# Altium schematic sheet LCD_PWR.SchDoc
size A4; SheetNumber: 5; SheetTotal: 9
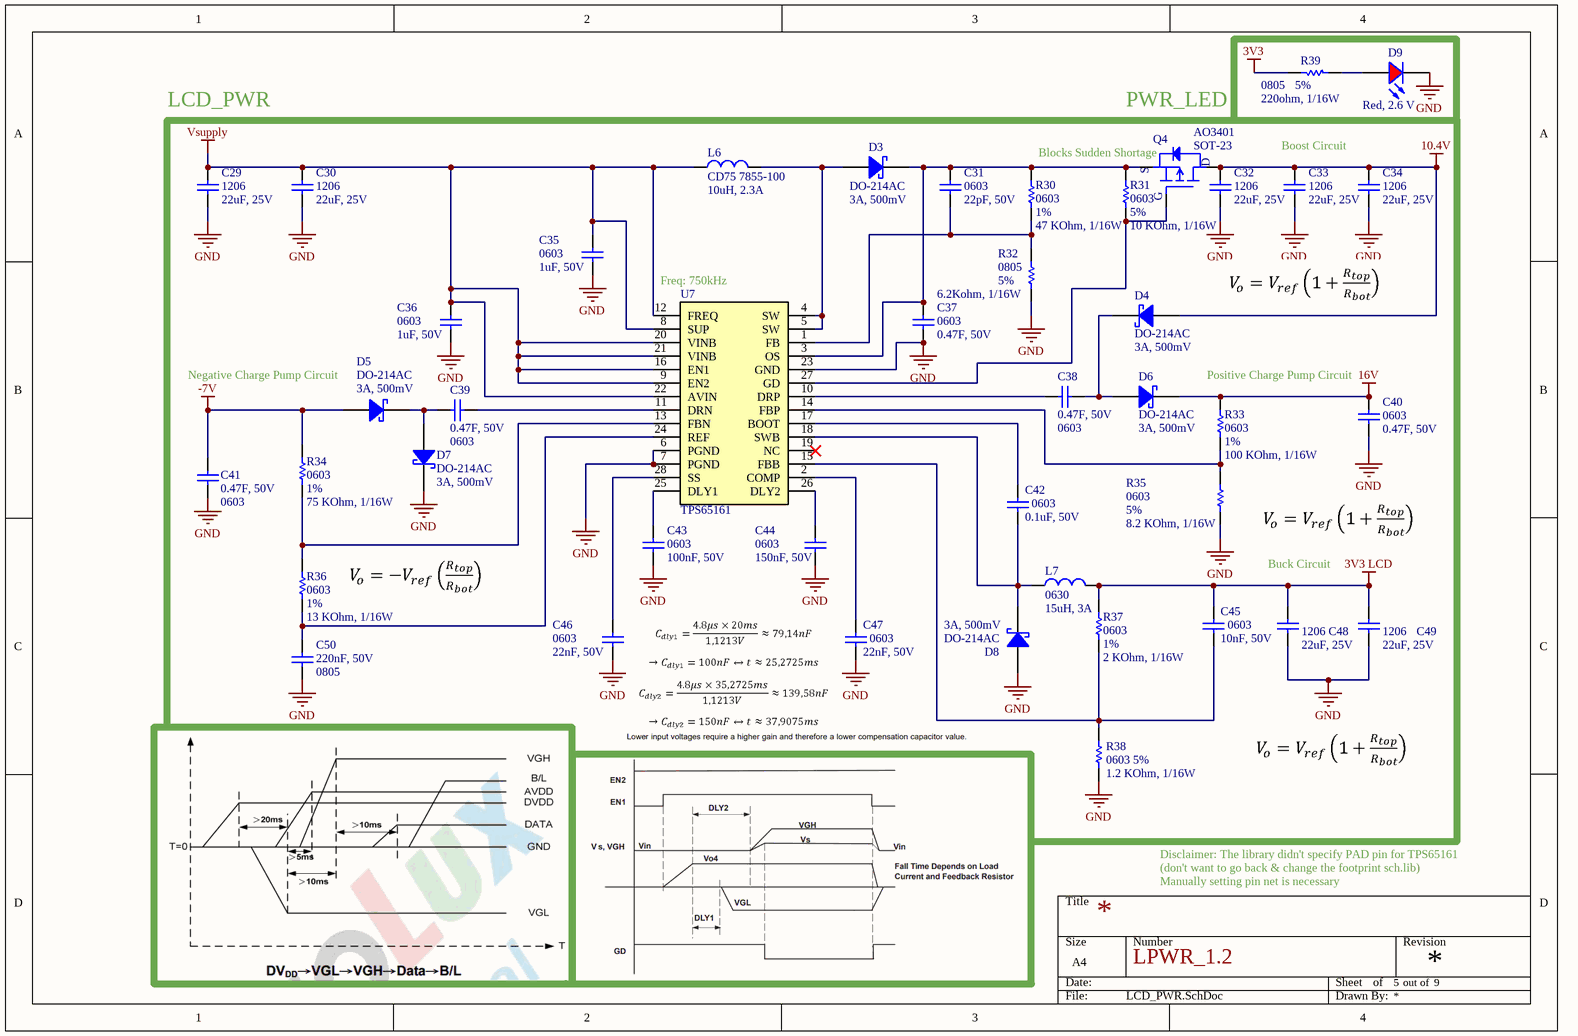
[diagram p0: LCD_PWR.SchDoc]

## Parts
C29  Package: 1206  [C_1206]  (hidden comment: 22uF, 25V)
C30  Package: 1206  [C_1206]  (hidden comment: 22uF, 25V)
C31  Package: 0603  [C_0603]  (hidden comment: 22pF, 50V)
C32  Package: 1206  [C_1206]  (hidden comment: 22uF, 25V)
C33  Package: 1206  [C_1206]  (hidden comment: 22uF, 25V)
C34  Package: 1206  [C_1206]  (hidden comment: 22uF, 25V)
C35  Package: 0603  [C_0603]  (hidden comment: 1uF, 50V)
C36  Package: 0603  [C_0603]  (hidden comment: 1uF, 50V)
C37  Package: 0603  [C_0603]  (hidden comment: 0.47F, 50V)
C38  Package: 0603  [C_0603]  (hidden comment: 0.47F, 50V)
C39  Package: 0603  [C_0603]  (hidden comment: 0.47F, 50V)
C40  Package: 0603  [C_0603]  (hidden comment: 0.47F, 50V)
C41  Package: 0603  [C_0603]  (hidden comment: 0.47F, 50V)
C42  Package: 0603  [C_0603]  (hidden comment: 0.1uF, 50V)
C43  Package: 0603  [C_0603]  (hidden comment: 100nF, 50V)
C44  Package: 0603  [C_0603]  (hidden comment: 150nF, 50V)
C45  Package: 0603  [C_0603]  (hidden comment: 10nF, 50V)
C46  Package: 0603  [C_0603]  (hidden comment: 22nF, 50V)
C47  Package: 0603  [C_0603]  (hidden comment: 22nF, 50V)
C48  Package: 1206  [C_1206]  (hidden comment: 22uF, 25V)
C49  Package: 1206  [C_1206]  (hidden comment: 22uF, 25V)
C50  Package: 0805  [C_0805]  (hidden comment: 220nF, 50V)
D3  Package: DO-214AC  [PKG_SMA (DO-214AC)]  (hidden comment: 3A, 500mV)
D4  Package: DO-214AC  [PKG_SMA (DO-214AC)]  (hidden comment: 3A, 500mV)
D5  Package: DO-214AC  [PKG_SMA (DO-214AC)]  (hidden comment: 3A, 500mV)
D6  Package: DO-214AC  [PKG_SMA (DO-214AC)]  (hidden comment: 3A, 500mV)
D7  Package: DO-214AC  [PKG_SMA (DO-214AC)]  (hidden comment: 3A, 500mV)
D8  Package: DO-214AC  [PKG_SMA (DO-214AC)]  (hidden comment: 3A, 500mV)
D9  Red, 2.6 V  [LED_1206]
L6  Package: CD75 7855-100  [COIL_CDRH]  (hidden comment: 10uH, 2.3A)
L7  Package: 0630  [COIL_74]  (hidden comment: 15uH, 3A)
Q4  AO3401  Package: SOT-23  [PKG_SOT-23]
R30  Package: 0603  Acc: 1%  [R_0603]  (hidden comment: 47 KOhm, 1/16W)
R31  Package: 0603  Acc: 5%  [R_0603]  (hidden comment: 10 KOhm, 1/16W)
R32  Package: 0805  Acc: 5%  [R_0805]  (hidden comment: 6.2Kohm, 1/16W)
R33  Package: 0603  Acc: 1%  [R_0603]  (hidden comment: 100 KOhm, 1/16W)
R34  Package: 0603  Acc: 1%  [R_0603]  (hidden comment: 75 KOhm, 1/16W)
R35  Package: 0603  Acc: 5%  [R_0603]  (hidden comment: 8.2 KOhm, 1/16W)
R36  Package: 0603  Acc: 1%  [R_0603]  (hidden comment: 13 KOhm, 1/16W)
R37  Package: 0603  Acc: 1%  [R_0603]  (hidden comment: 2 KOhm, 1/16W)
R38  Package: 0603  Acc: 5%  [R_0603]  (hidden comment: 1.2 KOhm, 1/16W)
R39  Package: 0805  Acc: 5%  [R_0805]  (hidden comment: 220ohm, 1/16W)
U7  TPS65161  [PKG_HTSSOP-28]

## Nets
3V3: R39.2
3V3 LCD: C45.2 C48.2 C49.2 L7.2 R37.2
10.4V: C32.2 C33.2 C34.2 D4.2(A) Q4.3(D)
16V: C40.2 D6.1(K) R33.2
-7V: C41.1 D5.2(A) R34.2
GND: C29.1 C30.1 C32.1 C33.1 C34.1 C35.1 C36.1 C37.1 C40.1 C41.2 C43.1 C44.1 C46.1 C47.1 C48.1 C49.1 C50.2 D7.1(K) D8.2(A) D9.1(K) R32.1 R35.1 R38.1 U7.6(PGND) U7.7(PGND) U7.23(GND)
Vsupply: C29.2 C30.2 C35.2 C36.2 L6.1 U7.8(SUP) U7.9(EN2) U7.12(FREQ) U7.16(EN1) U7.20(VINB) U7.21(VINB) U7.22(AVIN)
NetC31_1: C31.1 R30.1 R32.2 U7.1(FB)
NetC31_2: C31.2 C37.2 D3.1(K) Q4.2(S) R30.2 R31.2 U7.3(OS)
NetC38_1: C38.1 D4.1(K) D6.2(A)
NetC38_2: C38.2 U7.10(DRP)
NetC39_1: C39.1 U7.11(DRN)
NetC39_2: C39.2 D5.1(K) D7.2(A)
NetC42_1: C42.1 D8.1(K) L7.1 U7.18(SWB)
NetC42_2: C42.2 U7.17(BOOT)
NetC43_2: C43.2 U7.25(DLY1)
NetC44_2: C44.2 U7.26(DLY2)
NetC45_1: C45.1 R37.1 R38.2 U7.15(FBB)
NetC46_2: C46.2 U7.28(SS)
NetC47_2: C47.2 U7.2(COMP)
NetC50_1: C50.1 R36.1 U7.24(REF)
NetD3_2: D3.2(A) L6.2 U7.4(SW) U7.5(SW)
NetD9_2: D9.2(A) R39.1
NetQ4_1: Q4.1(G) R31.1 U7.27(GD)
NetR33_1: R33.1 R35.2 U7.14(FBP)
NetR34_1: R34.1 R36.2 U7.13(FBN)

Not connected (* = marked no-connect by the designer): U7 19(NC)*

## Notes on the sheet
- LCD_PWR
- PWR_LED
- (near Q4) Blocks Sudden Shortage
- Boost Circuit
- (near U7) Freq: 750kHz
- (near D5) Negative Charge Pump Circuit
- Positive Charge Pump Circuit
- Buck Circuit
- Disclaimer: The library didn't specify PAD pin for TPS65161
- (don't want to go back & change the footprint sch.lib)
- Manually setting pin net is necessary
- LPWR_1.2
- out of

## Library data of the parts
C29 C30 C32-C34 C48 C49 = CAP_1206: Manufacturer 1: Vishay; Manufacturer Part Number 1: CAP0805; Supplier 1: Thegioiic; Datasheet: https://www.mouser.de/datasheet/2/447/PYu_RC_Group_51_RoHS_L_11-1984063.pdf; Supplier Link: N/a; Value: 22uF, 25V
C31 C35-C47 = CAP_0603: Manufacturer 1: Vishay; Manufacturer Part Number 1: CAP0603; Supplier 1: Thegioiic; Datasheet: https://www.mouser.de/datasheet/2/447/PYu_RC_Group_51_RoHS_L_11-1984063.pdf; Supplier Link: N/a
  C31: Value: 22pF, 50V
  C35 C36: Value: 1uF, 50V
  C37-C41: Value: 0.47F, 50V
  C42: Value: 0.1uF, 50V
  C43: Value: 100nF, 50V
  C44: Value: 150nF, 50V
  C45: Value: 10nF, 50V
  C46 C47: Value: 22nF, 50V
C50 = CAP_0805: Manufacturer 1: Vishay; Manufacturer Part Number 1: CAP0805; Supplier 1: Thegioiic; Datasheet: https://www.mouser.de/datasheet/2/447/PYu_RC_Group_51_RoHS_L_11-1984063.pdf; Supplier Link: N/a; Value: 220nF, 50V
D3-D8 = SCHOTTKY: SS34; Manufacturer 1: OEM; Manufacturer Part Number 1: N/a; ComponentLink1Description: Datasheet; ComponentLink1URL: https://www.vishay.com/doc?89055; Supplier 1: Thegioiic; Datasheet: N/a; Supplier Link: N/a; Value: 3A, 500mV
D9 = RED: Red LED; Manufacturer 1: LITE-ON; Manufacturer Part Number 1: LEDR; ComponentLink1Description: Datasheet link; ComponentLink1URL: N/A; ComponentLink2Description: Supplier 1 URL; ComponentLink2URL: https://www.mouser.vn/ProductDetail/ROHM-Semiconductor/SML-H12U8TT86C?qs=HXFqYaX1Q2xs%2F%252BL6XLQEvw%3D%3D; ComponentLink3Description: Supplier 2 URL; ComponentLink3URL: https://www.digikey.com/en/products/detail/liteon/LTST-C171KRKT/386801; ComponentLink4Description: Supplier 3 URL; ComponentLink4URL: https://www.thegioiic.com/led-do-0805-dan-smd-trong-suot-harvatek; Supplier 1: ICDAYROI; Datasheet: https://www.mouser.com/datasheet/2/239/LTST-S326KGKFKT-1143909.pdf?srsltid=AfmBOorgg6Gh4PD3T9FRO6Da906Aqdqx3RSjbUQRSIXh-3hATfgAoF8Q; Supplier Link: https://icdayroi.com/led-smd-0805; Package: 1206; Value: Red, 2.6 V
L6 = IN_CD104_100: Manufacturer 1: OEM; Manufacturer Part Number 1: N/a; ComponentLink2Description: Supplier 1 URL; ComponentLink2URL: https://www.mouser.vn/ProductDetail/TDK/MLZ1608DR10DTD25?qs=u4%252BEJ9urDARQOELDKhLR2A%3D%3D; ComponentLink1Description: Datasheet; ComponentLink1URL: https://product.tdk.com/system/files/dam/doc/product/inductor/inductor/smd/catalog/inductor_automotive_decoupling_mlz1608_en.pdf?ref_disty=mouser; ComponentLink3Description: Supplier 2 URL; ComponentLink3URL: https://www.digikey.com/en/products/detail/tdk-corporation/MLZ1608DR10DTD25/4743170; ComponentLink4Description: Supplier 3 URL; Supplier 1: Thegioiic; Datasheet: N/a; Supplier Link: N/a; Value: 10uH, 2.3A
L7 = IN_0630: Manufacturer 1: OEM; Manufacturer Part Number 1: N/a; ComponentLink2Description: Supplier 1 URL; ComponentLink2URL: https://www.mouser.vn/ProductDetail/TDK/MLZ1608M100WTD25?qs=u4%252BEJ9urDATpNhOvJ54DAQ%3D%3D; ComponentLink1Description: Datasheet; ComponentLink1URL: https://product.tdk.com/system/files/dam/doc/product/inductor/inductor/smd/catalog/inductor_automotive_decoupling_mlz1608_en.pdf?ref_disty=mouser; ComponentLink3Description: Supplier 2 URL; ComponentLink3URL: https://www.digikey.com/en/products/detail/tdk-corporation/MLZ1608M100WTD25/4743176; ComponentLink4Description: Supplier 3 URL; Supplier 1: Thegioiic; Datasheet: N/a; Supplier Link: N/a; Value: 15uH, 3A
Q4 = AO3401: P-Channel 30 V 4A (Ta) 1.4W (Ta) Surface Mount SOT-23-3; Manufacturer 1: Alpha&Omega Semi.; Manufacturer Part Number 1: AO3401; Supplier 1: ICDayroi; Datasheet: https://www.snapeda.com/parts/AO3401/Alpha%20&%20Omega%20Semiconductor/datasheet/; Supplier Link: https://icdayroi.com/ao3401
R30 R31 R33-R38 = RES_0603: Manufacturer 1: Vishay; Manufacturer Part Number 1: RES0603; Supplier 1: Thegioiic; Datasheet: https://www.mouser.de/datasheet/2/447/PYu_RC_Group_51_RoHS_L_11-1984063.pdf; Supplier Link: N/a
  R30: Value: 47 KOhm, 1/16W
  R31: Value: 10 KOhm, 1/16W
  R33: Value: 100 KOhm, 1/16W
  R34: Value: 75 KOhm, 1/16W
  R35: Value: 8.2 KOhm, 1/16W
  R36: Value: 13 KOhm, 1/16W
  R37: Value: 2 KOhm, 1/16W
  R38: Value: 1.2 KOhm, 1/16W
R32 R39 = RES_0805: Manufacturer 1: Vishay; Manufacturer Part Number 1: RES0805; Supplier 1: Thegioiic; Datasheet: https://www.mouser.de/datasheet/2/447/PYu_RC_Group_51_RoHS_L_11-1984063.pdf; Supplier Link: N/a
  R32: Value: 6.2Kohm, 1/16W
  R39: Value: 220ohm, 1/16W
U7 = TPS65161: BIAS POWER SUPPLY FOR TV AND MONITOR TFT LCD PANELS; Manufacturer 1: TI; Manufacturer Part Number 1: TPS65161; Supplier 1: shoppee; Datasheet: https://www.ti.com/lit/ds/symlink/tps65161.pdf?ts=1780769383696&ref_url=https%253A%252F%252Fwww.google.com%252F; Supplier Link: https://shopee.vn/5-C%C3%81I-TPS65161PWPR-TSSOP28-TPS65161-TSSOP-28-TPS65161PW-TSSOP-TPS65161PWP-linh-ki%E1%BB%87n-%C4%91i%E1%BB%87n-t%E1%BB%AD-vanxy-i.1274879032.50207449630